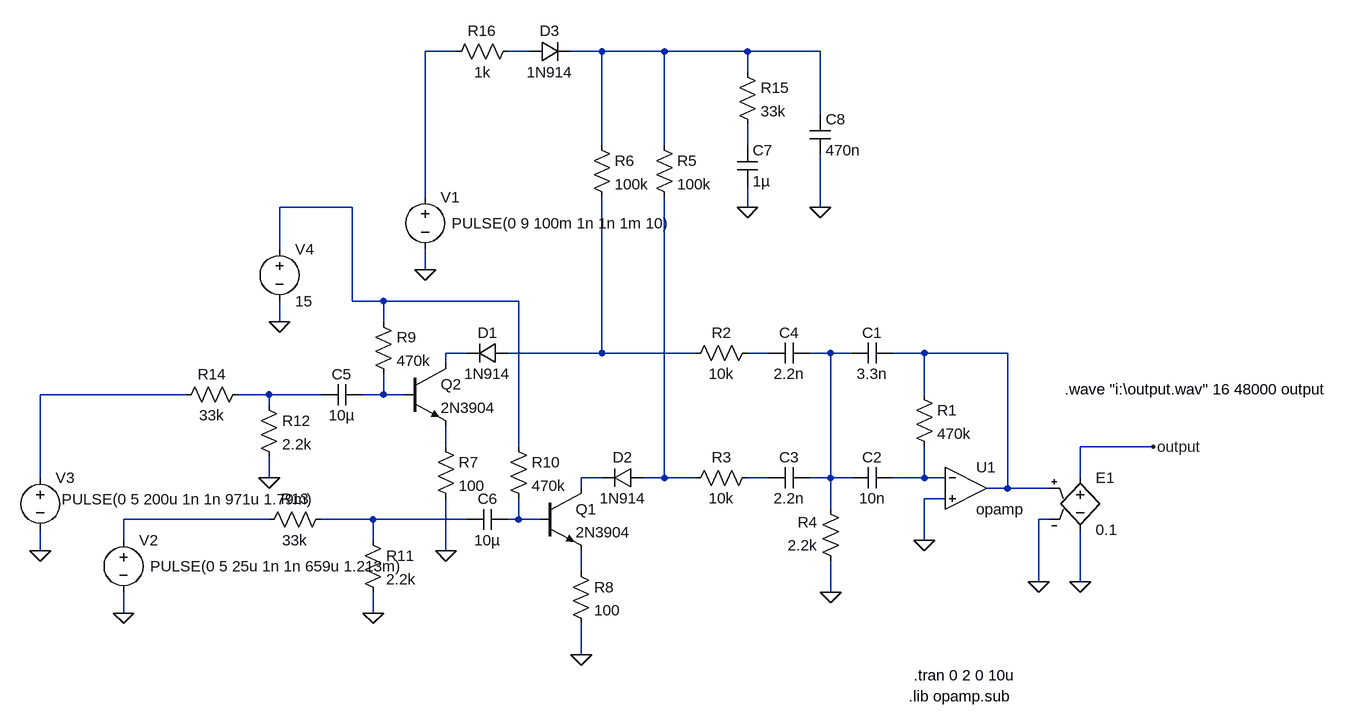
[diagram p0: schematic 808cb.asc]
808cb.asc, the LTspice schematic file:
Version 4
SHEET 1 1224 680
WIRE -608 -480 -656 -480
WIRE -496 -480 -528 -480
WIRE -384 -480 -432 -480
WIRE -288 -480 -384 -480
WIRE -160 -480 -288 -480
WIRE -48 -480 -160 -480
WIRE -160 -448 -160 -480
WIRE -48 -384 -48 -480
WIRE -384 -336 -384 -480
WIRE -288 -336 -288 -480
WIRE -160 -336 -160 -368
WIRE -656 -256 -656 -480
WIRE -768 -240 -880 -240
WIRE -160 -240 -160 -272
WIRE -48 -240 -48 -320
WIRE -880 -176 -880 -240
WIRE -656 -144 -656 -176
WIRE -768 -96 -768 -240
WIRE -720 -96 -768 -96
WIRE -512 -96 -720 -96
WIRE -880 -64 -880 -96
WIRE -720 -64 -720 -96
WIRE -592 -16 -624 -16
WIRE -384 -16 -384 -256
WIRE -384 -16 -528 -16
WIRE -240 -16 -384 -16
WIRE -128 -16 -160 -16
WIRE -32 -16 -64 -16
WIRE 0 -16 -32 -16
WIRE 112 -16 64 -16
WIRE 240 -16 112 -16
WIRE -624 0 -624 -16
WIRE -1024 48 -1248 48
WIRE -896 48 -944 48
WIRE -816 48 -896 48
WIRE -720 48 -720 16
WIRE -720 48 -752 48
WIRE -688 48 -720 48
WIRE 112 48 112 -16
WIRE -896 64 -896 48
WIRE -624 128 -624 96
WIRE -512 128 -512 -96
WIRE 464 128 352 128
WIRE -1248 176 -1248 48
WIRE -896 176 -896 144
WIRE -384 176 -416 176
WIRE -288 176 -288 -256
WIRE -288 176 -320 176
WIRE -240 176 -288 176
WIRE -128 176 -160 176
WIRE -32 176 -32 -16
WIRE -32 176 -64 176
WIRE 0 176 -32 176
WIRE 112 176 112 128
WIRE 112 176 64 176
WIRE 144 176 112 176
WIRE 352 176 352 128
WIRE -416 192 -416 176
WIRE 240 192 240 -16
WIRE 240 192 208 192
WIRE 304 192 240 192
WIRE 144 208 112 208
WIRE -32 224 -32 176
WIRE -896 240 -1120 240
WIRE -736 240 -816 240
WIRE -592 240 -736 240
WIRE -512 240 -512 208
WIRE -512 240 -528 240
WIRE -480 240 -512 240
WIRE 304 240 288 240
WIRE -1120 272 -1120 240
WIRE -736 272 -736 240
WIRE 112 272 112 208
WIRE -1248 288 -1248 256
WIRE -624 288 -624 208
WIRE -416 320 -416 288
WIRE 288 336 288 240
WIRE 352 336 352 256
WIRE -32 352 -32 304
WIRE -1120 384 -1120 352
WIRE -736 384 -736 352
WIRE -416 448 -416 400
FLAG 112 272 0
FLAG -656 -144 0
FLAG 352 336 0
FLAG 288 336 0
FLAG 464 128 output
FLAG -32 352 0
FLAG -1120 384 0
FLAG -1248 288 0
FLAG -624 288 0
FLAG -416 448 0
FLAG -736 384 0
FLAG -896 176 0
FLAG -160 -240 0
FLAG -48 -240 0
FLAG -880 -64 0
SYMBOL Opamps\\opamp 176 128 R0
SYMATTR InstName U1
SYMBOL res 96 32 R0
SYMATTR InstName R1
SYMATTR Value 470k
SYMBOL voltage -656 -272 R0
WINDOW 3 41 56 Left 2
WINDOW 123 0 0 Left 2
WINDOW 39 0 0 Left 2
SYMATTR Value PULSE(0 9 100m 1n 1n 1m 10)
SYMATTR InstName V1
SYMBOL e 352 160 R0
SYMATTR InstName E1
SYMATTR Value 0.1
SYMBOL cap 64 -32 R90
WINDOW 0 0 32 VBottom 2
WINDOW 3 32 32 VTop 2
SYMATTR InstName C1
SYMATTR Value 3.3n
SYMBOL cap 64 160 R90
WINDOW 0 0 32 VBottom 2
WINDOW 3 32 32 VTop 2
SYMATTR InstName C2
SYMATTR Value 10n
SYMBOL cap -64 160 R90
WINDOW 0 0 32 VBottom 2
WINDOW 3 32 32 VTop 2
SYMATTR InstName C3
SYMATTR Value 2.2n
SYMBOL cap -64 -32 R90
WINDOW 0 0 32 VBottom 2
WINDOW 3 32 32 VTop 2
SYMATTR InstName C4
SYMATTR Value 2.2n
SYMBOL res -144 -32 R90
WINDOW 0 0 56 VBottom 2
WINDOW 3 32 56 VTop 2
SYMATTR InstName R2
SYMATTR Value 10k
SYMBOL res -144 160 R90
WINDOW 0 0 56 VBottom 2
WINDOW 3 32 56 VTop 2
SYMATTR InstName R3
SYMATTR Value 10k
SYMBOL res -16 320 R180
WINDOW 0 36 76 Left 2
WINDOW 3 36 40 Left 2
SYMATTR InstName R4
SYMATTR Value 2.2k
SYMBOL voltage -1120 256 R0
WINDOW 3 41 56 Left 2
WINDOW 123 0 0 Left 2
WINDOW 39 0 0 Left 2
SYMATTR Value PULSE(0 5 25u 1n 1n 659u 1.213m)
SYMATTR InstName V2
SYMBOL voltage -1248 160 R0
WINDOW 3 33 49 Left 2
WINDOW 123 0 0 Left 2
WINDOW 39 0 0 Left 2
SYMATTR Value PULSE(0 5 200u 1n 1n 971u 1.79m)
SYMATTR InstName V3
SYMBOL res -304 -352 R0
SYMATTR InstName R5
SYMATTR Value 100k
SYMBOL res -400 -352 R0
SYMATTR InstName R6
SYMATTR Value 100k
SYMBOL diode -528 -32 R90
WINDOW 0 0 32 VBottom 2
WINDOW 3 32 32 VTop 2
SYMATTR InstName D1
SYMATTR Value 1N914
SYMBOL diode -320 160 R90
WINDOW 0 0 32 VBottom 2
WINDOW 3 32 32 VTop 2
SYMATTR InstName D2
SYMATTR Value 1N914
SYMBOL npn -480 192 R0
SYMATTR InstName Q1
SYMATTR Value 2N3904
SYMBOL npn -688 0 R0
SYMATTR InstName Q2
SYMATTR Value 2N3904
SYMBOL res -640 112 R0
SYMATTR InstName R7
SYMATTR Value 100
SYMBOL res -432 304 R0
SYMATTR InstName R8
SYMATTR Value 100
SYMBOL res -736 -80 R0
SYMATTR InstName R9
SYMATTR Value 470k
SYMBOL res -528 112 R0
SYMATTR InstName R10
SYMATTR Value 470k
SYMBOL cap -752 32 R90
WINDOW 0 0 32 VBottom 2
WINDOW 3 32 32 VTop 2
SYMATTR InstName C5
SYMATTR Value 10µ
SYMBOL cap -528 224 R90
WINDOW 0 0 32 VBottom 2
WINDOW 3 32 32 VTop 2
SYMATTR InstName C6
SYMATTR Value 10µ
SYMBOL res -752 256 R0
SYMATTR InstName R11
SYMATTR Value 2.2k
SYMBOL res -912 48 R0
SYMATTR InstName R12
SYMATTR Value 2.2k
SYMBOL res -800 224 R90
WINDOW 0 0 56 VBottom 2
WINDOW 3 32 56 VTop 2
SYMATTR InstName R13
SYMATTR Value 33k
SYMBOL res -928 32 R90
WINDOW 0 0 56 VBottom 2
WINDOW 3 32 56 VTop 2
SYMATTR InstName R14
SYMATTR Value 33k
SYMBOL cap -176 -336 R0
SYMATTR InstName C7
SYMATTR Value 1µ
SYMBOL cap -64 -384 R0
SYMATTR InstName C8
SYMATTR Value 470n
SYMBOL res -176 -464 R0
SYMATTR InstName R15
SYMATTR Value 33k
SYMBOL diode -496 -464 R270
WINDOW 0 32 32 VTop 2
WINDOW 3 0 32 VBottom 2
SYMATTR InstName D3
SYMATTR Value 1N914
SYMBOL res -512 -496 R90
WINDOW 0 0 56 VBottom 2
WINDOW 3 32 56 VTop 2
SYMATTR InstName R16
SYMATTR Value 1k
SYMBOL voltage -880 -192 R0
WINDOW 123 0 0 Left 2
WINDOW 39 0 0 Left 2
SYMATTR InstName V4
SYMATTR Value 15
TEXT 88 512 Left 2 !.lib opamp.sub
TEXT 96 480 Left 2 !.tran 0 2 0 10u
TEXT 328 40 Left 2 !.wave "i:\\output.wav" 16 48000 output

The netlist it stands for:
* 808cb.asc
XU1 N018 0 N010 opamp Aol=100K GBW=10Meg  ; pins invin noninvin out
R1 N010 N018 470k
V1 N001 0 PULSE(0 9 100m 1n 1n 1m 10)
E1 output 0 N010 0 0.1
C1 N010 N009 3.3n
C2 N018 N009 10n
C3 N009 N017 2.2n
C4 N009 N008 2.2n
R2 N008 N007 10k
R3 N017 N016 10k
R4 0 N009 2.2k
V2 N019 0 PULSE(0 5 25u 1n 1n 659u 1.213m)
V3 N011 0 PULSE(0 5 200u 1n 1n 971u 1.79m)
R5 N003 N016 100k
R6 N003 N007 100k
D1 N007 N006 1N914
D2 N016 N015 1N914
Q1 N015 N021 N022 0 2N3904
Q2 N006 N013 N014 0 2N3904
R7 N014 0 100
R8 N022 0 100
R9 N005 N013 470k
R10 N005 N021 470k
C5 N013 N012 10µ
C6 N021 N020 10µ
R11 N020 0 2.2k
R12 N012 0 2.2k
R13 N020 N019 33k
R14 N012 N011 33k
C7 N004 0 1µ
C8 N003 0 470n
R15 N003 N004 33k
D3 N002 N003 1N914
R16 N002 N001 1k
V4 N005 0 15
.model D D
.lib standard.dio
.model NPN NPN
.model PNP PNP
.lib standard.bjt
.lib opamp.sub
.tran 0 2 0 10u
.wave "i:\output.wav" 16 48000 output
.backanno
.end